# EAGLE design sterownik3 (EAGLE 7.6.0)
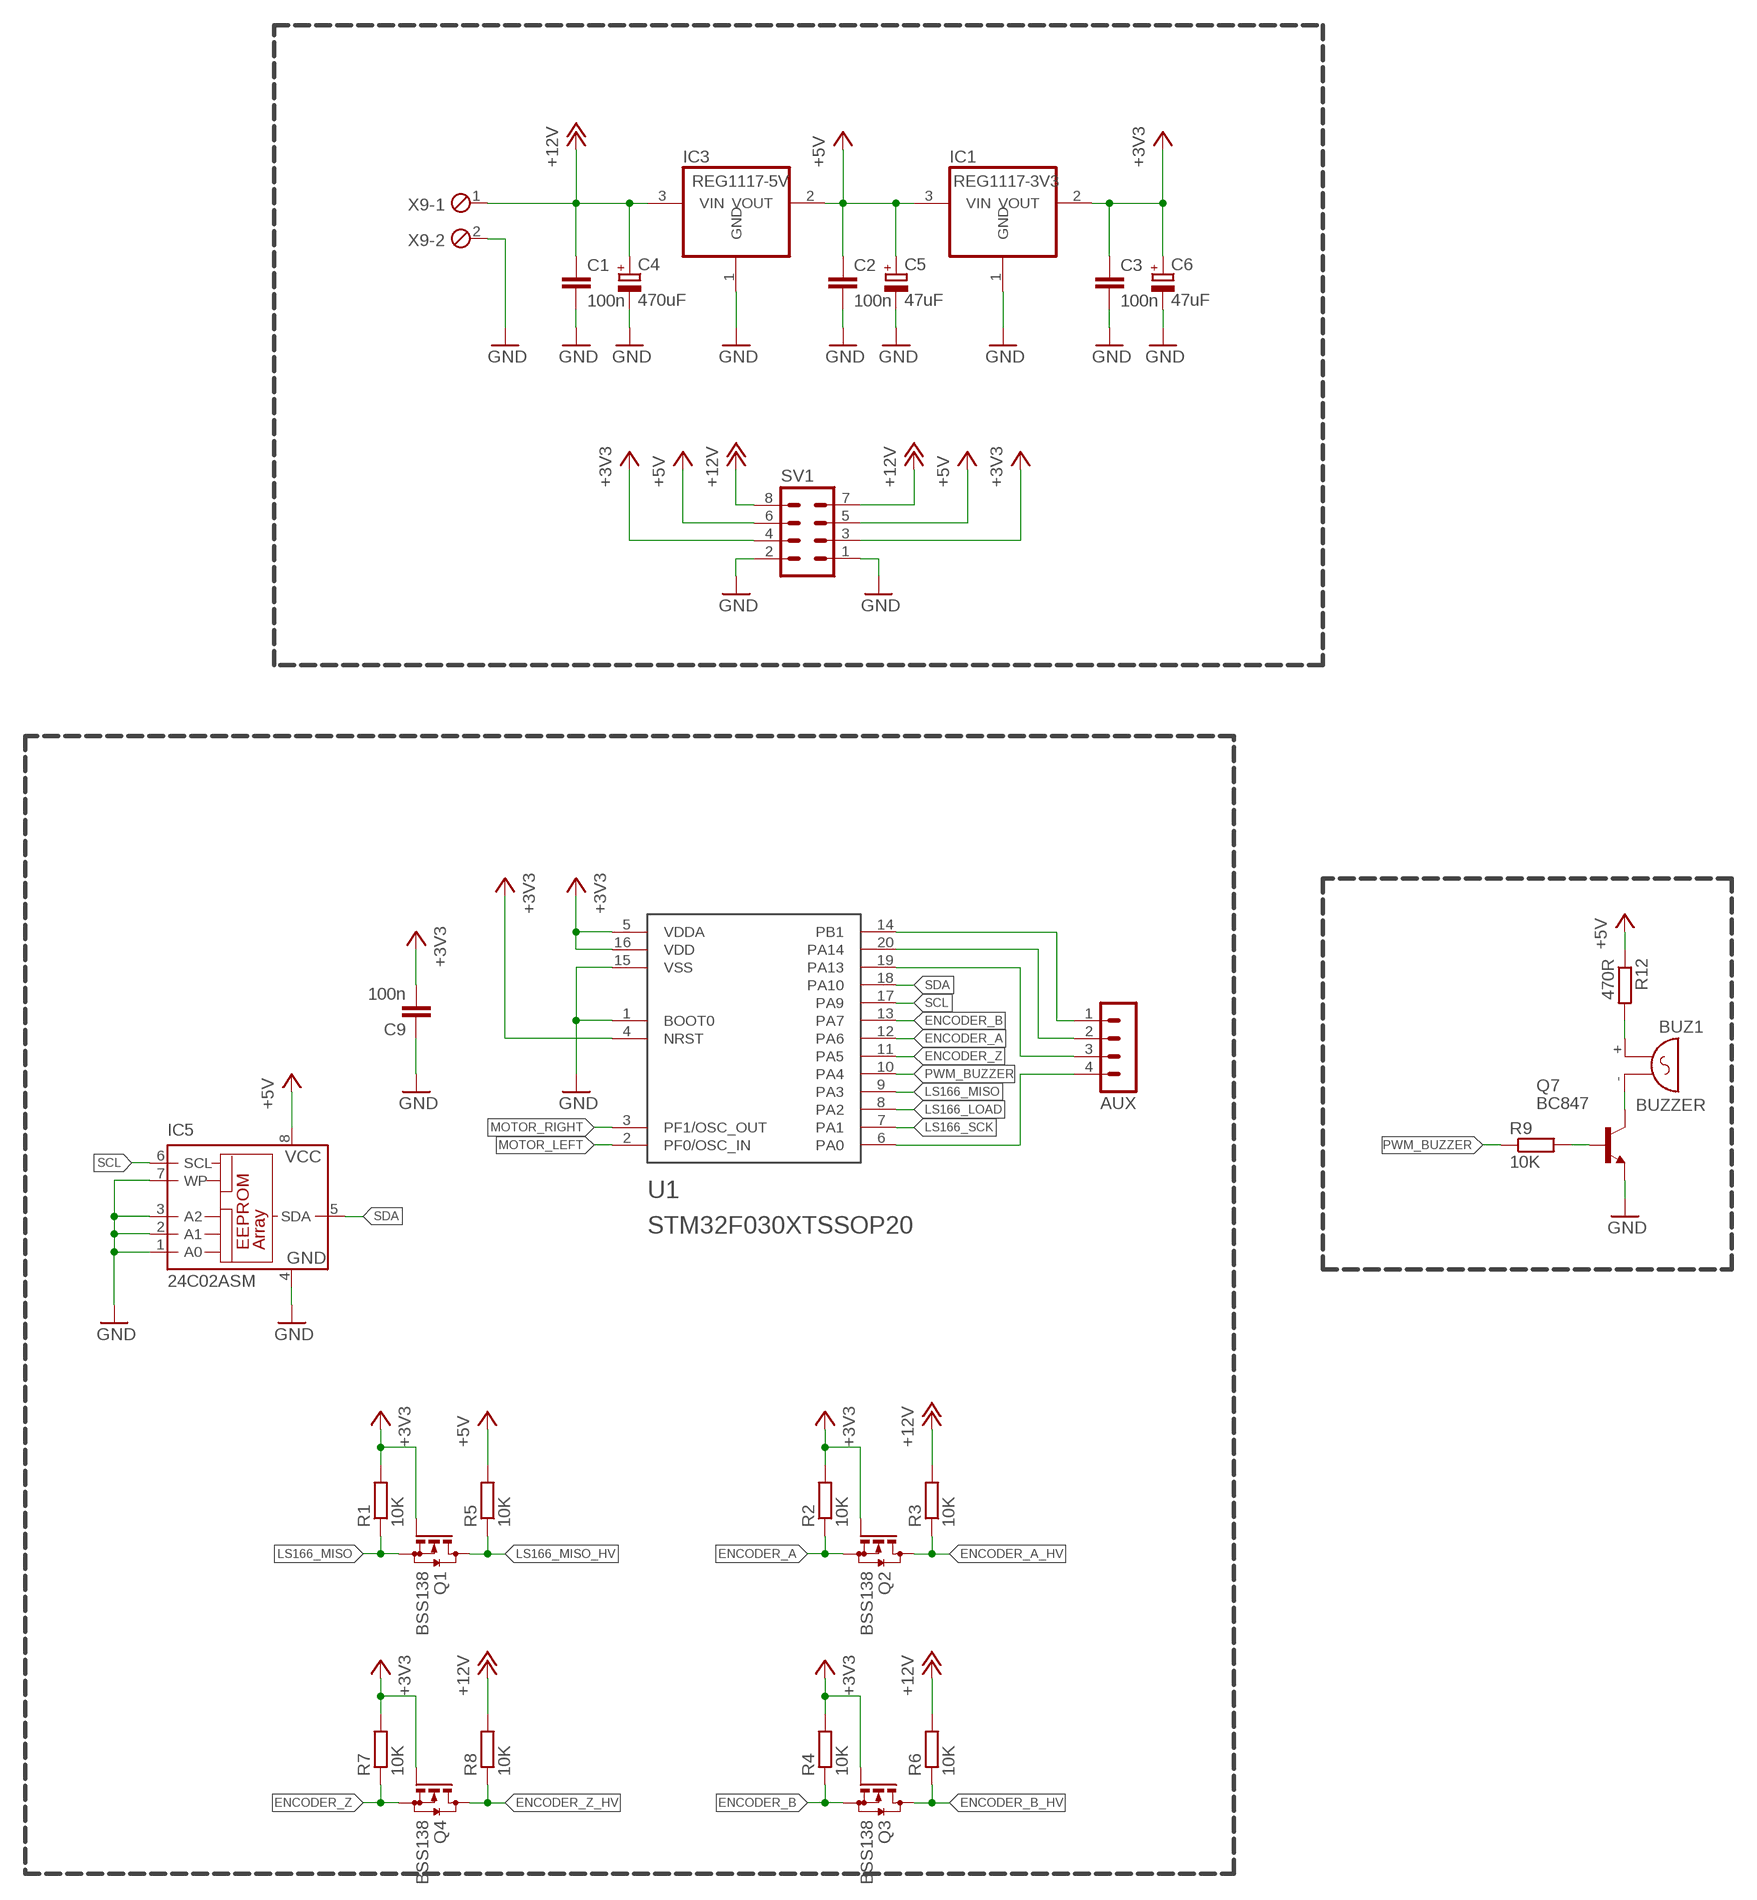
[diagram p0: schematic, sheet 1, part 1 of 2]
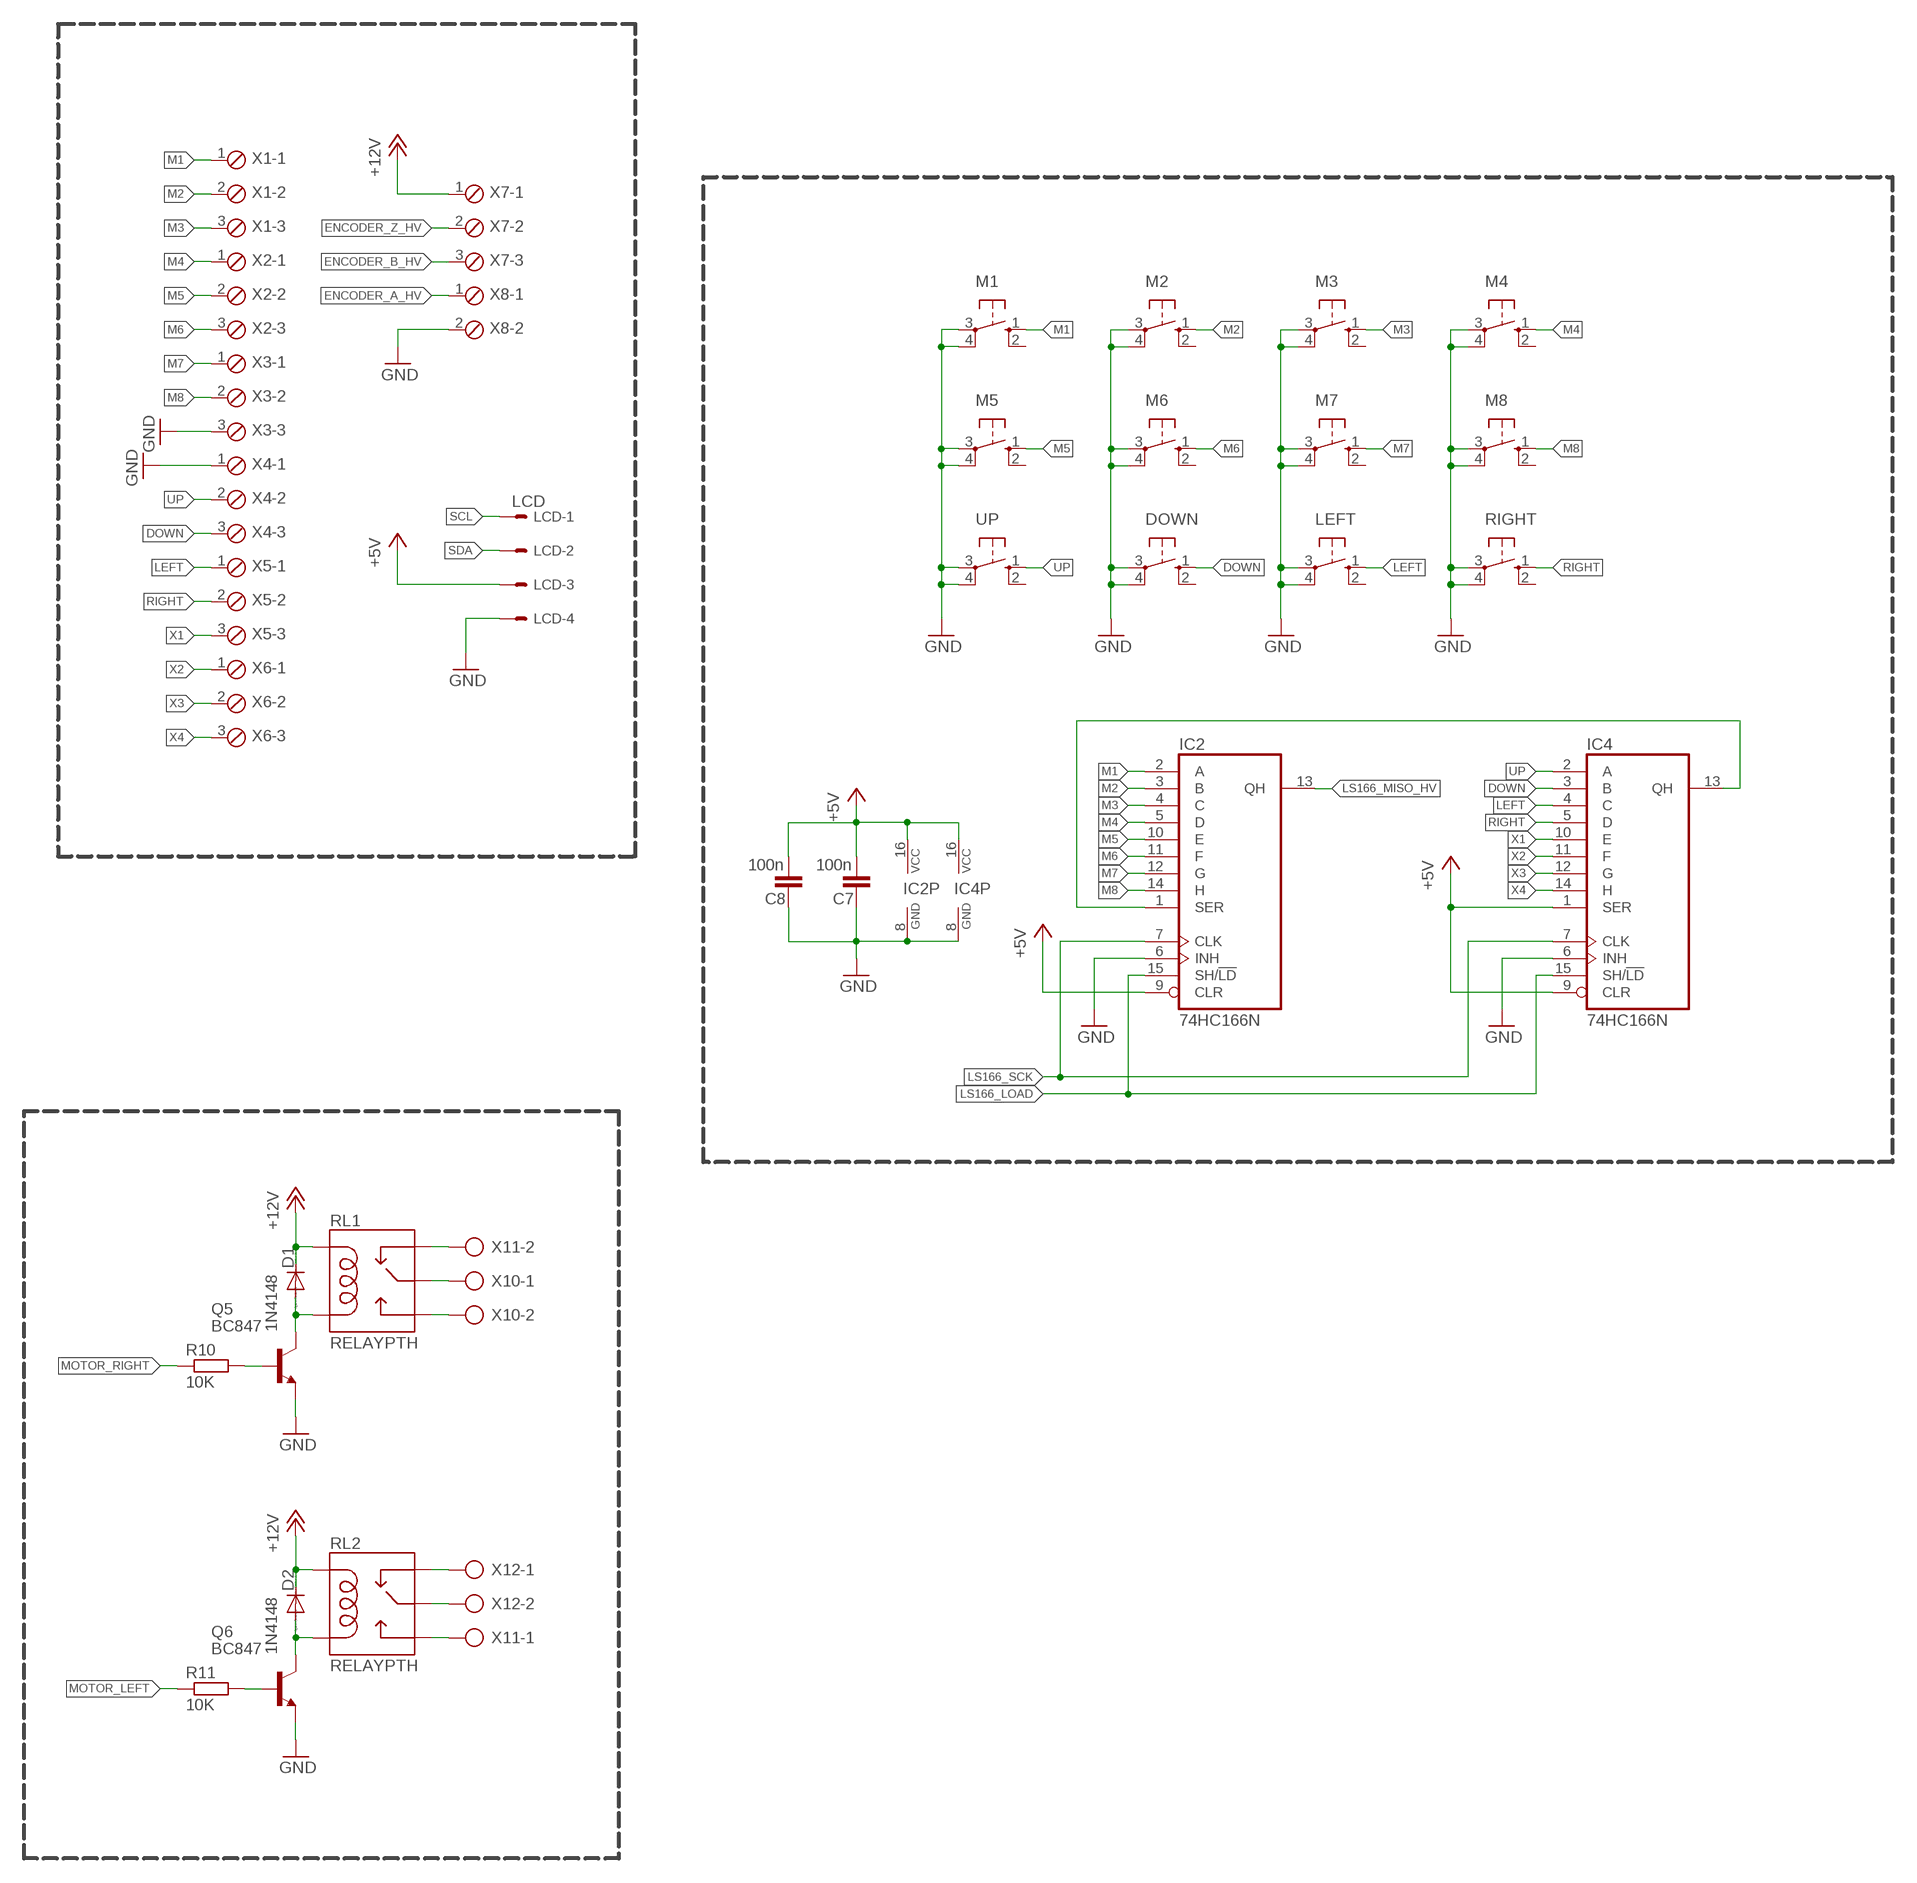
[diagram p1: schematic, sheet 1, part 2 of 2]

## Parts
AUX  MA04-1  [MA04-1]
BUZ1  BUZZER  F/QMX  [F/QMX]
C1  100n  C-EUC0805  [C0805]
C2  100n  C-EUC0805  [C0805]
C3  100n  C-EUC0805  [C0805]
C4  470uF  CPOL-EUE5-8.5  [E5-8,5]
C5  47uF  CPOL-EUE5-6  [E5-6]
C6  47uF  CPOL-EUE5-6  [E5-6]
C7  100n  C-EUC0805  [C0805]
C8  100n  C-EUC0805  [C0805]
C9  100n  C-EUC0805  [C0805]
D1  1N4148  1N4148DO35-7  [DO35-7]
D2  1N4148  1N4148DO35-7  [DO35-7]
DOWN  10-XX  [B3F-10XX]
IC1  REG1117-3V3  REG1117  [SOT223]
IC2  74HC166N  [DIL16]
IC3  REG1117-5V  REG1117  [SOT223]
IC4  74HC166N  [DIL16]
IC5  24C02ASM  [SO-08M]
LCD  LCD  22-27-2041-04  [6410-04]
LEFT  10-XX  [B3F-10XX]
M1  10-XX  [B3F-10XX]
M2  10-XX  [B3F-10XX]
M3  10-XX  [B3F-10XX]
M4  10-XX  [B3F-10XX]
M5  10-XX  [B3F-10XX]
M6  10-XX  [B3F-10XX]
M7  10-XX  [B3F-10XX]
M8  10-XX  [B3F-10XX]
Q1  BSS138  BSS123  [SOT23]
Q2  BSS138  BSS123  [SOT23]
Q3  BSS138  BSS123  [SOT23]
Q4  BSS138  BSS123  [SOT23]
Q5  BC847  [SOT23]
Q6  BC847  [SOT23]
Q7  BC847  [SOT23]
R1  10K  R-EU_R0805  [R0805]
R2  10K  R-EU_R0805  [R0805]
R3  10K  R-EU_R0805  [R0805]
R4  10K  R-EU_R0805  [R0805]
R5  10K  R-EU_R0805  [R0805]
R6  10K  R-EU_R0805  [R0805]
R7  10K  R-EU_R0805  [R0805]
R8  10K  R-EU_R0805  [R0805]
R9  10K  R-EU_R0805  [R0805]
R10  10K  R-EU_R0805  [R0805]
R11  10K  R-EU_R0805  [R0805]
R12  470R  R-EU_R0805  [R0805]
RIGHT  10-XX  [B3F-10XX]
RL1  RELAYPTH  [SRD-05VDC-SL-C]
RL2  RELAYPTH  [SRD-05VDC-SL-C]
SV1  MA04-2  [MA04-2]
U1  STM32F030XTSSOP20  [TSSOP-20]
UP  10-XX  [B3F-10XX]
X1  MPT3  [3POL254]
X2  MPT3  [3POL254]
X3  MPT3  [3POL254]
X4  MPT3  [3POL254]
X5  MPT3  [3POL254]
X6  MPT3  [3POL254]
X7  MPT3  [3POL254]
X8  MPT2  [2POL254]
X9  MPT2  [2POL254]
X10  AK500/2  [AK500/2]
X11  AK500/2  [AK500/2]
X12  AK500/2  [AK500/2]

## Nets
+3V3: C3.1 C6.+ C9.2 IC1.2(VOUT) Q1.1(G) Q2.1(G) Q3.1(G) Q4.1(G) R1.2 R2.2 R4.2 R7.2 SV1.3 SV1.4 U1.4(NRST) U1.5(VDDA) U1.16(VDD)
+5V: C2.1 C5.+ C7.1 C8.1 IC1.3(VIN) IC2.9(CLR) IC2.16(VCC) IC3.2(VOUT) IC4.1(SER) IC4.9(CLR) IC4.16(VCC) IC5.8(VCC) LCD.3 R5.2 R12.1 SV1.5 SV1.6
+12V: C1.1 C4.+ D1.C D2.C IC3.3(VIN) R3.2 R6.2 R8.2 RL1.COIL1 RL2.COIL1 SV1.7 SV1.8 X7.1 X9.1
DOWN: DOWN.1(S) IC4.3(B) X4.3
ENCODER_A: Q2.2(S) R2.1 U1.12(PA6)
ENCODER_A_HV: Q2.3(D) R3.1 X8.1
ENCODER_B: Q3.2(S) R4.1 U1.13(PA7)
ENCODER_B_HV: Q3.3(D) R6.1 X7.3
ENCODER_Z: Q4.2(S) R7.1 U1.11(PA5)
ENCODER_Z_HV: Q4.3(D) R8.1 X7.2
GND: C1.2 C2.2 C3.2 C4.- C5.- C6.- C7.2 C8.2 C9.1 DOWN.3(P) DOWN.4(P1) IC1.1(GND) IC2.6(INH) IC2.8(GND) IC3.1(GND) IC4.6(INH) IC4.8(GND) IC5.1(A0) IC5.2(A1) IC5.3(A2) IC5.4(GND) IC5.7(WP) LCD.4 LEFT.3(P) LEFT.4(P1) M1.3(P) M1.4(P1) M2.3(P) M2.4(P1) M3.3(P) M3.4(P1) M4.3(P) M4.4(P1) M5.3(P) M5.4(P1) M6.3(P) M6.4(P1) M7.3(P) M7.4(P1) M8.3(P) M8.4(P1) Q5.2(E) Q6.2(E) Q7.2(E) RIGHT.3(P) RIGHT.4(P1) SV1.1 SV1.2 U1.1(BOOT0) U1.15(VSS) UP.3(P) UP.4(P1) X3.3 X4.1 X8.2 X9.2
LEFT: IC4.4(C) LEFT.1(S) X5.1
LS166_LOAD: IC2.15(SH/!LD) IC4.15(SH/!LD) U1.8(PA2)
LS166_MISO: Q1.2(S) R1.1 U1.9(PA3)
LS166_MISO_HV: IC2.13(QH) Q1.3(D) R5.1
LS166_SCK: IC2.7(CLK) IC4.7(CLK) U1.7(PA1)
M1: IC2.2(A) M1.1(S) X1.1
M2: IC2.3(B) M2.1(S) X1.2
M3: IC2.4(C) M3.1(S) X1.3
M4: IC2.5(D) M4.1(S) X2.1
M5: IC2.10(E) M5.1(S) X2.2
M6: IC2.11(F) M6.1(S) X2.3
M7: IC2.12(G) M7.1(S) X3.1
M8: IC2.14(H) M8.1(S) X3.2
MOTOR_LEFT: R11.1 U1.2(PF0/OSC_IN)
MOTOR_RIGHT: R10.1 U1.3(PF1/OSC_OUT)
N$1: AUX.3 U1.19(PA13)
N$2: AUX.2 U1.20(PA14)
N$3: AUX.1 U1.14(PB1)
N$4: AUX.4 U1.6(PA0)
N$5: BUZ1.- Q7.3(C)
N$6: BUZ1.+ R12.2
N$7: Q7.1(B) R9.2
N$8: Q6.1(B) R11.2
N$9: Q5.1(B) R10.2
N$10: D1.A Q5.3(C) RL1.COIL0
N$11: D2.A Q6.3(C) RL2.COIL0
N$12: RL2.SWCLOSED(SWCLOSE) X12.1
N$13: RL1.SWCOMMON X10.1
N$14: RL2.SWOPEN X11.1
N$15: RL1.SWCLOSED(SWCLOSE) X11.2
N$16: RL2.SWCOMMON X12.2
N$17: RL1.SWOPEN X10.2
N$18: IC2.1(SER) IC4.13(QH)
PWM_BUZZER: R9.1 U1.10(PA4)
RIGHT: IC4.5(D) RIGHT.1(S) X5.2
SCL: IC5.6(SCL) LCD.1 U1.17(PA9)
SDA: IC5.5(SDA) LCD.2 U1.18(PA10)
UP: IC4.2(A) UP.1(S) X4.2
X1: IC4.10(E) X5.3
X2: IC4.11(F) X6.1
X3: IC4.12(G) X6.2
X4: IC4.14(H) X6.3
Unconnected: DOWN.2(S1) LEFT.2(S1) M1.2(S1) M2.2(S1) M3.2(S1) M4.2(S1) M5.2(S1) M6.2(S1) M7.2(S1) M8.2(S1) RIGHT.2(S1) UP.2(S1)

## Library data of the parts
AUX = con-lstb:MA04-1: PIN HEADER; OC_FARNELL: unknown; OC_NEWARK: unknown
BUZ1 = buzzer:F/QMX: BUZZER Source: Buerklin; OC_FARNELL: unknown; OC_NEWARK: unknown
C1-C3 C7-C9 = rcl:C-EU: CAPACITOR, European symbol
C4-C6 = rcl:CPOL-EU: POLARIZED CAPACITOR, European symbol
D1 D2 = diode:1N4148: DIODE high speed (Philips)
DOWN LEFT M1-M8 RIGHT UP = switch-omron:10-XX: OMRON SWITCH; MPN: B3F-1000; OC_FARNELL: 176432; OC_NEWARK: 36M3542
IC1 IC3 = burr-brown:REG1117: 800mA and 1A Low Dropout (LDO) Positive Regulator 1.8V, 2.5V, 2.85V, 3.3V, 5V, and Adj; MPN: REG1117; OC_FARNELL: 1097566; OC_NEWARK: 14P6981
IC2 IC4 = 74xx-eu:74*166: 8-bit parallel load SHIFT REGISTER
IC5 = microchip:24*: Serial EEPROM I2C; MF: MICROCHIP; MPN: 24C02C/SN; OC_FARNELL: 1084339; OC_NEWARK: 96K4065
LCD = con-molex:22-?-04: CONNECTOR wire to board 2.54 mm (.1 inch) pitch header; OC_FARNELL: unknown; OC_NEWARK: unknown
Q1-Q4 = transistor-small-signal:BSS123: N-CHANNEL MOS FET
Q5-Q7 = transistor:BC847: NPN TRANSISTOR
R1-R12 = rcl:R-EU_: RESISTOR, European symbol
RL1 RL2 = SRD-05VDC-SL-C:RELAY: SPDT relay (COM-00101)
SV1 = con-lstb:MA04-2: PIN HEADER; OC_FARNELL: unknown; OC_NEWARK: unknown
U1 = stm32f030x:STM32F030X
X1-X7 = con-phoenix-254:MPT3: PHOENIX CONNECTOR; OC_FARNELL: unknown; OC_NEWARK: unknown
X8 X9 = con-phoenix-254:MPT2: PHOENIX CONNECTOR; OC_FARNELL: unknown; OC_NEWARK: unknown
X10-X12 = con-ptr500:AK500/2: CONNECTOR; OC_FARNELL: unknown; OC_NEWARK: unknown

## Board
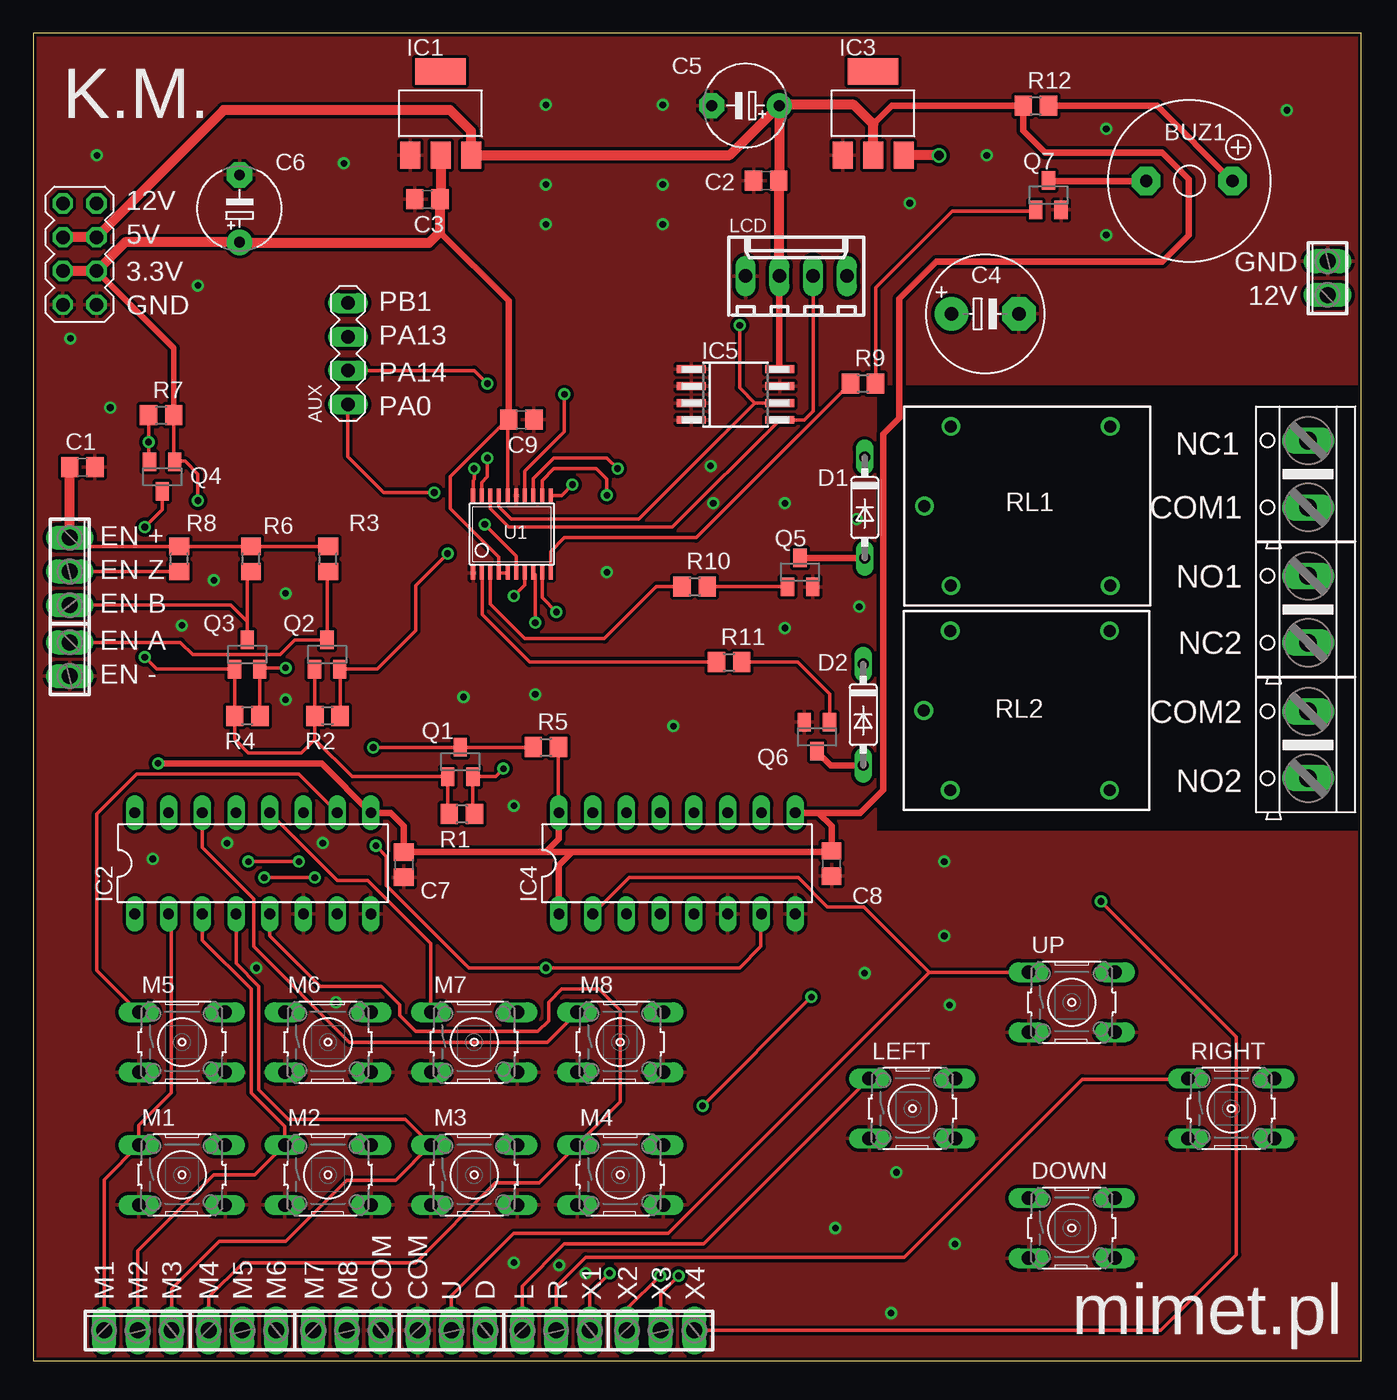
[diagram p2: board, top side]
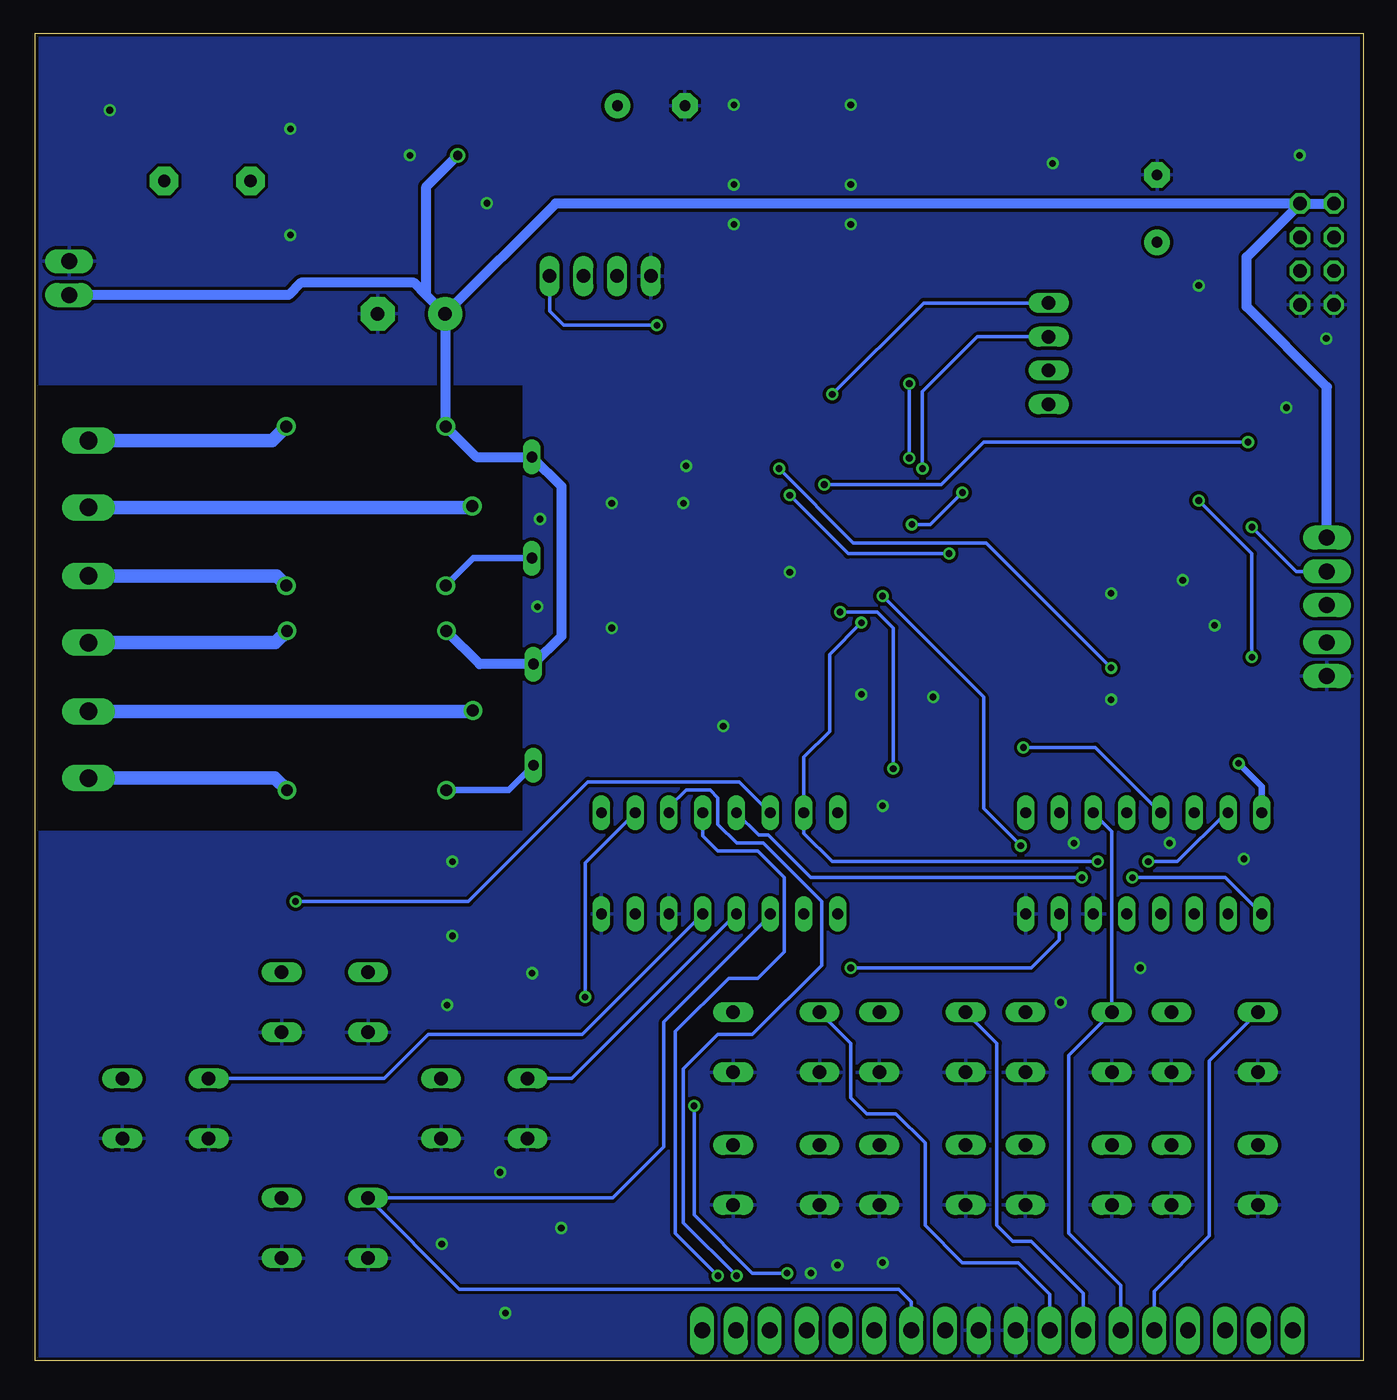
[diagram p3: board, bottom side, seen from below]

Size 100 x 100 mm. Coordinates in mm from the lower left corner, seen from the top.
Outline: 0,0 100,0 100,100 0,100 0,0
Copper layers (1*16): Top 0.035mm / dielectric 1.5mm / Bottom 0.035mm
Design rules "default *": minimum track width 8mil, minimum drill 0.4mm, track to track 8mil, track to pad 8mil, pad to pad 8mil, via to via 8mil, smd to smd 8mil, copper to edge 10mil, drill to drill 8mil, minimum pad ring 10mil, minimum via ring 8mil, stop-mask expansion 4mil, vias tented up to drill 0mil, thermal gap 10mil

### Footprints (pad centres in the part's own frame; a part is rotated, then mirrored left to right if it is on the bottom)
MA04-1 = drill 1.016 long: 1 -3.81,0; 2 -1.27,0; 3 1.27,0; 4 3.81,0
F/QMX = drill 0.914 pad 2.159 octagon: + 3.251,0; - -3.251,0
C0805 = smd 1.3 x 1.5: 1 -0.95,0; 2 0.95,0
E5-8,5 = drill 1.016 pad 2.54: + -2.54,0 | drill 1.016 pad 2.54 octagon: - 2.54,0
E5-6 = drill 0.813 pad 1.905: + -2.54,0 | drill 0.813 pad 1.905 octagon: - 2.54,0
DO35-7 = drill 0.813 long: A 3.81,0; C -3.81,0
B3F-10XX = drill 1.016 long: 1 -3.251,2.261; 2 3.251,2.261; 3 -3.251,-2.261; 4 3.251,-2.261
SOT223 = smd 1.499 x 2.007: 1 -2.261,-3.15; 2 0.025,-3.15; 3 2.311,-3.15 | smd 3.81 x 2.007: 4 0,3.15
DIL16 = drill 0.813 long: 1 -8.89,-3.81; 2 -6.35,-3.81; 3 -3.81,-3.81; 4 -1.27,-3.81; 5 1.27,-3.81; 6 3.81,-3.81; 7 6.35,-3.81; 8 8.89,-3.81; 9 8.89,3.81; 10 6.35,3.81; 11 3.81,3.81; 12 1.27,3.81; 13 -1.27,3.81; 14 -3.81,3.81; 15 -6.35,3.81; 16 -8.89,3.81
SO-08M = smd 0.6 x 2.2: 1 -1.905,-3.33; 2 -0.635,-3.33; 3 0.635,-3.33; 4 1.905,-3.33; 5 1.905,3.33; 6 0.635,3.33; 7 -0.635,3.33; 8 -1.905,3.33
6410-04 = drill 1.016 long: 1 3.81,0; 2 1.27,0; 3 -1.27,0; 4 -3.81,0
SOT23 = smd 1 x 1.4: 1 -0.95,-1.1; 2 0.95,-1.1; 3 0,1.1
R0805 = smd 1.3 x 1.5: 1 -0.95,0; 2 0.95,0
SRD-05VDC-SL-C = drill 0.9: COIL0 -5.39,-6.12; COIL1 -5.39,5.88; SWCLOSED 6.61,-6.12; SWCOMMON -7.39,-0.12; SWOPEN 6.61,5.88
MA04-2 = drill 1.016 octagon: 1 -3.81,-1.27; 2 -3.81,1.27; 3 -1.27,-1.27; 4 -1.27,1.27; 5 1.27,-1.27; 6 1.27,1.27; 7 3.81,-1.27; 8 3.81,1.27
TSSOP-20 = smd 0.305 x 0.991: 1 -2.925,-2.918; 2 -2.275,-2.918; 3 -1.625,-2.918; 4 -0.975,-2.918; 5 -0.325,-2.918; 6 0.325,-2.918; 7 0.975,-2.918; 8 1.625,-2.918; 9 2.275,-2.918; 10 2.925,-2.918; 11 2.925,2.918; 12 2.275,2.918; 13 1.625,2.918; 14 0.975,2.918; 15 0.325,2.918; 16 -0.325,2.918; 17 -0.975,2.918; 18 -1.625,2.918; 19 -2.275,2.918; 20 -2.925,2.918
3POL254 = drill 1.2 long: 1 -2.54,0; 2 0,0; 3 2.54,0
2POL254 = drill 1.2 long: 1 -1.27,0; 2 1.27,0
AK500/2 = drill 1.321 long: 1 -2.515,0; 2 2.515,0

### Placement (x,y rotation side)
AUX  23.7,75.87 270 top
BUZ1  87.05,88.87 0 top
C1  3.7,67.31 0 top
C2  55.19,88.89 180 top
C3  29.68,87.49 180 top
C4  71.68,78.86 0 top
C5  53.63,94.54 180 top
C6  15.54,86.79 90 top
C7  27.91,37.37 270 top
C8  60.11,37.46 270 top
C9  36.75,70.89 180 top
D1  62.61,64.27 270 top
D2  62.49,48.67 270 top
DOWN  78.2,10 0 top
IC1  30.66,93.96 0 top
IC2  16.54,37.47 0 top
IC3  63.23,93.96 0 top
IC4  48.48,37.47 0 top
IC5  52.88,72.78 270 top
LCD  57.46,81.7 0 top
LEFT  66.2,19 0 top
M1  11.2,14 0 top
M2  22.2,14 0 top
M3  33.2,14 0 top
M4  44.2,14 0 top
M5  11.2,24 0 top
M6  22.2,24 0 top
M7  33.2,24 0 top
M8  44.2,24 0 top
Q1  32.16,45.11 0 top
Q2  22.13,53.2 0 top
Q3  16.11,53.2 0 top
Q4  9.71,66.6 180 top
Q5  57.74,59.4 0 top
Q6  59.01,47 180 top
Q7  76.44,87.8 0 top
R1  32.28,41.18 180 top
R2  22.16,48.58 180 top
R3  22.2,60.4 90 top
R4  16.12,48.58 180 top
R5  38.6,46.22 0 top
R6  16.4,60.4 90 top
R7  9.64,71.22 0 top
R8  11,60.4 90 top
R9  62.48,73.62 0 top
R10  49.81,58.33 0 top
R11  52.4,52.62 0 top
R12  75.49,94.53 0 top
RIGHT  90.2,19 0 top
RL1  74.49,64.5 0 top
RL2  74.44,49.1 0 top
SV1  3.5,83.36 90 top
U1  36.04,62.27 0 top
UP  78.2,27 0 top
X1  7.87,2.29 0 top
X2  15.75,2.29 0 top
X3  23.62,2.29 0 top
X4  31.5,2.29 0 top
X5  39.37,2.29 0 top
X6  47.24,2.29 0 top
X7  2.75,59.45 270 top
X8  2.75,52.85 270 top
X9  97.46,81.55 90 top
X10  96,66.8 90 top
X11  96,56.6 90 top
X12  96,46.4 90 top

### Tracks (layer width: path | path; a pad name or v marks a point on that pad's centre or on a via)
+3V3  (via drill 0.5)
  Top 0.25: R7.2 10.59,67.77 10.6,67.76 | Q3.1 R4.2 15.17,46.83 16.2,45.8 20.2,45.8 21.21,46.81 | Q3.1 | Q2.1 21.21,52.07 R2.2 21.21,46.81 | R1.2 31.21,41.3 Q1.1 24.01,44.01 21.21,46.81 | C9.2 35.72,70.22 U1.16 | U1.5 U1.4 35.06,60.53 31.4,64.2 31.4,66.6 35.8,71 | Q3.1 9.31,52.09 v8.4,53 | 10.6,67.76 Q4.1 | 10.6,67.76 11.44,67.76 12.4,66.8 v12.4,64.8
  Top 0.4: R7.2 10.59,76.27 SV1.3
  Top 0.5: C9.2 35.8,71 35.8,79.86 30.63,85.03
  Top 0.75: IC1.2 30.68,87.55 C3.1 30.63,85.03 29.8,84.2 15.59,84.2 C6.+ 6.93,84.25 SV1.3 SV1.4
  Bottom 0.25: v8.4,53 8.4,60.8 v12.4,64.8
+5V  (via drill 0.5)
  Top 0.25: R5.2 39.55,41.32 IC4.16
  Top 0.5: C8.1 60.11,40.29 59.12,41.28 IC4.9 62.28,41.28 64,43 64,69.8 65.2,71 65.2,80 68,82.8 85,82.8 87,84.8 87,89 85,91 76.2,91 74.54,92.66 R12.1 64.64,94.53 63.26,93.14 | C8.1 59.82,38.32 40.6,38.32 | 40.6,38.32 38.6,38.32 | 38.6,38.32 C7.1 27.91,40.29 26.92,41.28 IC2.9 21.71,45 v9.4,45 | C8.1 | LCD.3 56.19,74.7 IC5.8 | IC4.16 39.59,39.31 38.6,38.32 | IC4.1 39.59,37.31 40.6,38.32
  Top 0.75: IC3.2 63.26,93.14 61.8,94.6 56.23,94.6 C5.+ | C5.+ 56.17,88.92 C2.1 56.14,81.75 LCD.3 | C5.+ 52.44,90.81 IC1.3 32.97,92.63 31.4,94.2 14.34,94.2 SV1.5 SV1.6
  Bottom 0.5: IC2.16 7.65,43.25 v9.4,45
+12V  (via drill 0.7)
  Top 0.25: X7.1 3.4,61.35 R8.2 R6.2 R3.2
  Top 0.75: v68.2,90.8 65.55,90.8 IC3.3 | X7.1 arc-90 X7.1 C1.1
  Bottom 0.75: 70.56,80.28 C4.+ | C4.+ 69.14,70.42 RL1.COIL1 66.8,68.08 D1.C 60.4,65.87 60.4,54.57 D2.C 66.55,52.48 RL2.COIL1 | 70.56,80.28 70.56,88.44 v68.2,90.8 | SV1.7 60.83,87.17 C4.+ | SV1.7 SV1.8 | X7.1 2.75,73.35 8.8,79.4 8.8,83.14 SV1.7 | 70.56,80.28 71.48,81.2 80,81.2 80.92,80.28 X9.1
DOWN
  Bottom 0.25: X4.3 34.04,4.44 35,5.4 68.09,5.4 DOWN.1 56.54,12.26 52.67,16.13 52.67,25.53 44.67,33.53 IC4.3
ENCODER_A  (via drill 0.5)
  Top 0.25: R2.1 23.11,52.07 Q2.2 25.9,52.1 28.8,55 28.8,58.4 v31.2,60.8 | v43.2,65.2 43.2,66.4 42.4,67.2 39.2,67.2 38.31,66.31 U1.12
  Bottom 0.25: v31.2,60.8 38.8,60.8 v43.2,65.2
ENCODER_A_HV
  Top 0.25: X8.1 11.08,54.12 12,53.2 18.6,53.2 19.7,54.3 Q2.3 22.13,59.38 R3.1
ENCODER_B  (via drill 0.5)
  Top 0.25: R4.1 Q3.2 17.16,52.2 v19,52.2 | v44,67.2 43.2,68 39.2,68 37.66,66.47 U1.13
  Bottom 0.25: v19,52.2 28.4,61.6 38.4,61.6 v44,67.2
ENCODER_B_HV
  Top 0.25: X7.3 14.89,56.91 16.11,55.69 Q3.3 16.11,59.16 R6.1
ENCODER_Z  (via drill 0.5)
  Top 0.25: R7.1 v8.69,69.2 8.69,68.8 8.69,67.77 Q4.2 | U1.11 39.79,65.19 v40.6,66
  Bottom 0.25: v40.6,66 31.8,66 28.6,69.2 v8.69,69.2
ENCODER_Z_HV  (via drill 0.5)
  Top 0.25: v8.4,62.8 9.71,64.11 Q4.3 | R8.1 X7.2
  Bottom 0.25: X7.2 5.05,59.45 v8.4,62.8
GND  (via drill 0.5)
  other vias: 2.8,77 12.4,81 4.8,90.8 23.4,90.2 5.8,71.8 32.4,50 37.8,50.2 36.2,41.8 11.2,55.4 13.6,58.8 19,57.8 19,49.8 43.2,59.4 51,67.4 51.2,64.6 56.6,64.6 38.6,94.6 47.4,94.6 38.6,88.6 38.6,85.6 47.4,85.6 47.4,88.6 66,87.2 71.8,90.8 80.8,92.8 80.8,84.8 56.6,55.2 62.2,56.8 62,63.4 9,37.8 21.8,39 14.6,39 16.8,29.6 22.8,27 36.2,7.4 39.6,7.2 41.6,6.6 64.6,3.6 60.4,10 69.4,8.8 65,14.2 62.6,29.2 68.6,32 69,26.8 68.6,37.6 48.2,47.8 94.4,94.2
  pour Bottom (isolate 0.25): -4.2,-4 105.4,-4 105.4,39.8 63.2,39.8 63.2,73.6 105.2,73.6 105.2,105.4 -4.2,105.4
  pour Top (isolate 0.25): -4,-4 105.6,-4 105.6,39.8 63.4,39.8 63.4,73.6 105.4,73.6 105.4,105.4 -4,105.4
LEFT
  Top 0.25: X5.1 36.83,5.63 40,8.8 50.49,8.8 LEFT.1
  Bottom 0.25: IC4.4 59.61,21.26 LEFT.1
LS166_LOAD  (via drill 0.5)
  Top 0.25: v37.8,55.6 37.8,59.22 U1.8 | v20,37.6 v16.2,37.6
  Bottom 0.25: v37.8,55.6 40.2,53.2 40.2,47.4 42.13,45.47 IC4.15 42.13,39.73 40,37.6 v20,37.6 | v16.2,37.6 14,37.6 10.32,41.28 IC2.15
LS166_MISO  (via drill 0.5)
  Top 0.25: R1.1 33.11,41.3 Q1.2 34.81,44.01 v35.4,44.6 | v39.4,56.4 38.31,57.48 U1.9
  Bottom 0.25: v35.4,44.6 35.4,55.2 36.6,56.4 v39.4,56.4
LS166_MISO_HV  (via drill 0.5)
  Top 0.25: R5.1 Q1.3 v25.61,46.21 v25.6,46.2
  Bottom 0.25: v25.6,46.2 20.19,46.2 IC2.13
LS166_SCK  (via drill 0.5)
  Top 0.25: IC4.7 54.8,33.63 54.8,31.2 53.2,29.6 v38.6,29.6 32.8,29.6 26.6,35.8 26.6,38 v25.8,38.8 | U1.7 37.02,58.41 v36.2,57.6
  Bottom 0.25: IC2.7 22.89,31.71 25,29.6 v38.6,29.6 | v36.2,57.6 28.6,50 28.6,41.6 v25.8,38.8
M1
  Top 0.25: X1.1 5.33,13.65 M1.1 7.95,17.75 10.4,20.2 10.4,33.45 IC2.2
M2
  Top 0.25: X1.2 7.87,8.27 13.6,14 16.69,14 M2.1 18.95,17.65 16.4,20.2 16.4,28 12.73,31.67 IC2.3
M3
  Top 0.25: X1.3 10.41,5.41 14,9 19,9 23.6,13.6 27.29,13.6 M3.1 28.01,18.2 19.2,18.2 17,20.4 17,28.2 15.27,29.93 IC2.4
M4
  Top 0.25: X2.1 13.21,4.81 15.8,7.4 28.8,7.4 34.8,13.4 38.09,13.4 M4.1 44.2,19.51 44.2,26.4 42.6,28 39.8,28 38.8,27 38.8,25.6 38,24.8 28.8,24.8 27.6,26 27.6,26.8 26.2,28.2 21.6,28.2 17.81,31.99 IC2.5
M5
  Top 0.25: M5.1 4.8,29.41 4.8,41.2 7.8,44.2 20,44.2 22.89,41.31 IC2.10
  Bottom 0.25: X2.2 15.75,5.25 11.6,9.4 11.6,22.61 M5.1
M6
  Bottom 0.25: X2.3 18.29,5.69 22.2,9.6 22.2,23.01 M6.1 18.95,39.88 IC2.11
M7
  Top 0.25: M7.1 29.95,31.45 25.2,36.2 22.89,36.2 IC2.12
  Bottom 0.25: X3.1 21.08,5.08 25,9 26.4,9 27.6,10.2 27.6,23.91 M7.1
M8
  Top 0.25: M8.1 38.69,24 23.8,24 16.6,31.2 16.6,34.8 12.73,38.67 IC2.14
  Bottom 0.25: X3.2 23.62,5.02 26,7.4 30.2,7.4 33,10.2 33,16.4 35.2,18.6 37.4,18.6 38.6,19.8 38.6,23.91 M8.1
MOTOR_LEFT
  Top 0.25: R11.1 37.38,52.62 33.8,56.2 33.8,59.32 U1.2
MOTOR_RIGHT
  Top 0.25: R10.1 46.93,58.33 43,54.4 37,54.4 34.4,57 34.4,59.34 U1.3
N$1  (via drill 0.5)
  Top 0.25: AUX.3 33.2,74.6 v34.2,73.6 | U1.19 33.77,66.17 34.2,66.6 v34.2,68
  Bottom 0.25: v34.2,73.6 v34.2,68
N$2  (via drill 0.5)
  Top 0.25: U1.20 33.12,66.31 33.2,66.4 v33.2,67.2
  Bottom 0.25: AUX.2 29.06,77.14 33.2,73 v33.2,67.2
N$3  (via drill 0.5)
  Top 0.25: v40,72.8 40,70 37,67 37,65.2 U1.14
  Bottom 0.25: AUX.1 33.12,79.68 v40,72.8
N$4  (via drill 0.5)
  Top 0.25: v34,63 36.37,60.63 U1.6 | v30.2,65.4 26.4,65.4 23.7,68.1 AUX.4
  Bottom 0.25: v30.2,65.4 32.6,63 v34,63
N$5
  Top 0.5: BUZ1.- 76.47,88.87 Q7.3
N$6
  Top 0.5: R12.2 84.64,94.53 BUZ1.+
N$7
  Top 0.25: R9.2 63.43,80.83 69.2,86.6 75.39,86.6 Q7.1
N$8
  Top 0.25: Q6.1 59.96,50.24 57.58,52.62 R11.2
N$9
  Top 0.25: Q5.1 56.76,58.33 R10.2
N$10
  Top 0.5: D1.A 57.78,60.46 Q5.3
  Bottom 0.5: D1.A 67.02,60.46 RL1.COIL0
N$11
  Top 0.5: D2.A 60.05,44.86 Q6.3
  Bottom 0.5: RL2.COIL0 64.37,42.98 D2.A
N$12
  Bottom 1: X12.1 81.95,43.88 RL2.SWCLOSED
N$13
  Bottom 1: X10.1 67.19,64.28 RL1.SWCOMMON
N$14
  Bottom 1: X11.1 81.94,54.09 RL2.SWOPEN
N$15
  Bottom 1: X11.2 81.83,59.12 RL1.SWCLOSED
N$16
  Bottom 1: X12.2 67.11,48.91 RL2.SWCOMMON
N$17
  Bottom 1: X10.2 82.17,69.31 RL1.SWOPEN
N$18  (via drill 0.5)
  Top 0.25: v17.4,36.4 v21.2,36.4
  Bottom 0.25: IC2.1 10.39,36.4 v17.4,36.4 | v21.2,36.4 41.6,36.4 44.8,39.6 45.53,39.6 IC4.13
PWM_BUZZER
  Top 0.25: R9.1 49.91,62 40,62 38.97,60.97 U1.10
RIGHT
  Top 0.25: X5.2 39.37,5.57 41.6,7.8 65.6,7.8 79,21.2 86.89,21.2 RIGHT.1
  Bottom 0.25: RIGHT.1 73.74,21.26 70.4,24.6 58.81,24.6 IC4.5
SCL  (via drill 0.5)
  Top 0.25: IC5.6 54.34,72.14 | U1.17 35.06,64.33 36,63.4 45.6,63.4 54.34,72.14 | v53.2,78 53.2,73.29 54.34,72.14
  Bottom 0.25: LCD.1 61.27,79.07 60.2,78 v53.2,78
SDA
  Top 0.25: LCD.2 58.73,71.53 58.08,70.88 IC5.5 48.13,62.8 35.8,62.8 34.41,64.19 U1.18
UP
  Top 0.25: X4.2 31.5,4.9 36.2,9.6 47.8,9.6 67.46,29.26 | 67.46,29.26 UP.1 | IC4.2 44.87,36.4 57.6,36.4 59.8,34.2 62.52,34.2 67.46,29.26
X1  (via drill 0.5)
  Top 0.25: v58.6,27.4 v50.4,19.2 | X5.3 41.91,5.11 v43.4,6.6
  Bottom 0.25: IC4.10 58.6,37.51 v58.6,27.4 | v43.4,6.6 46,6.6 50.4,11 v50.4,19.2
X2  (via drill 0.5)
  Top 0.25: X6.1 44.7,3.9 v47.2,6.4
  Bottom 0.25: v47.2,6.4 51.2,10.4 51.2,22 48.6,24.6 46,24.6 40.8,29.8 40.8,34.6 45.2,39 47.2,39 48.6,40.4 48.6,42.4 49.2,43 51,43 52.29,41.71 IC4.11
X3  (via drill 0.5)
  Top 0.25: X6.2 47.24,5.04 v48.6,6.4
  Bottom 0.25: v48.6,6.4 51.8,9.6 51.8,24.8 47.8,28.8 45.6,28.8 43.6,30.8 43.6,36.4 45.6,38.4 48.6,38.4 49.75,39.55 IC4.12
X4  (via drill 0.5)
  Top 0.25: X6.3 84.89,2.29 90.6,8 90.6,24.4 v80.4,34.6
  Bottom 0.25: v80.4,34.6 67.4,34.6 58.4,43.6 46.99,43.6 IC4.14

### Text on the board
tPlace: K.M. | 12V | 5V | GND | 3.3V | 12V | GND | PB1 | PA13 | PA14 | PA0 | NC1 | COM1 | EN + | NO1 | EN Z | EN B | NC2 | EN A | EN - | COM2 | NO2 | M1 | M2 | M3 | M4 | M5 | M6 | M7 | M8 | COM | COM | U | D | L | R | X1 | X2 | X3 | X4 | mimet.pl